# Altium schematic sheet Power.SchDoc
size A4; SheetNumber: 1; SheetTotal: 4
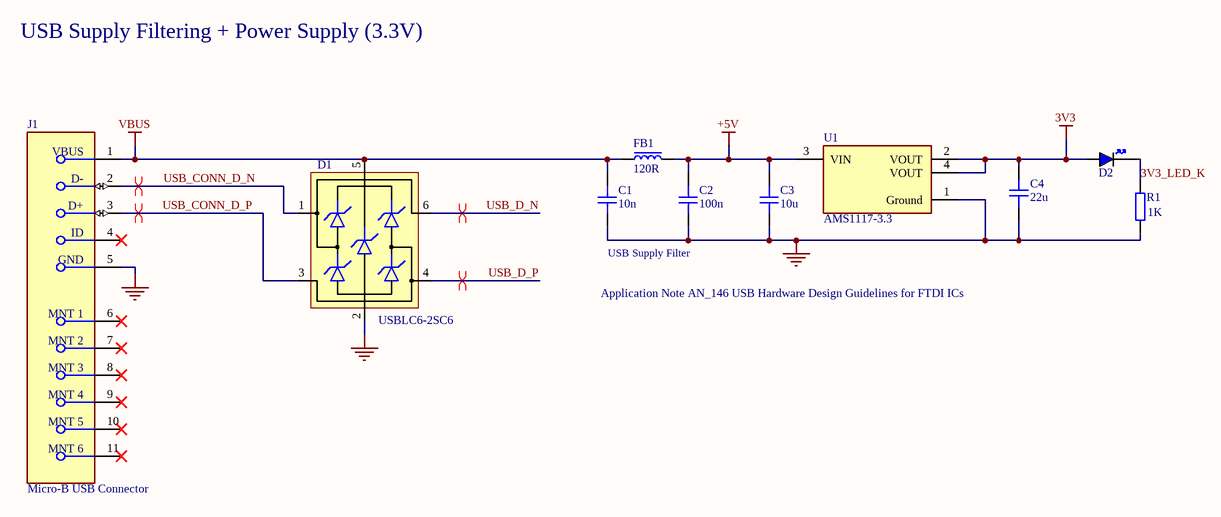
[diagram p0: Power.SchDoc]

## Parts
C1  10n  [CAP_0603]
C2  100n  [CAP_0603]
C3  10u  [CAP_0603]
C4  22u  [CAP_0603]
D1  USBLC6-2SC6  [SOT-23-6]
D2  BLUE  [LED_0402_BLUE]  (value not drawn)
FB1  120R  [FB_0603]
J1  Micro-B USB Connector  [FP-473460001-MFG]
R1  1K  [RES_0402]
U1  AMS1117-3.3  [FP-AMS1117-IPC_C]

## Nets
3V3: C4.2 D2.A U1.2(VOUT) U1.4(VOUT)
+5V: C2.2 C3.2 FB1.2 U1.3(VIN)
GND: C1.1 C2.1 C3.1 C4.1 D1.2(GND) J1.5(GND) R1.2 U1.1(Ground)
VBUS: C1.2 D1.5(VBUS) FB1.1 J1.1(VBUS)
3V3_LED_K: D2.K R1.1
USB_CONN_D_N: D1.1(IO1) J1.2(D-)
USB_CONN_D_P: D1.3(IO2) J1.3(D+)
USB_D_N: D1.6(IO1)
USB_D_P: D1.4(IO2)

Not connected (* = marked no-connect by the designer): J1 4(ID)* 6(MNT_1)* 7(MNT_2)* 8(MNT_3)* 9(MNT_4)* 10(MNT_5)* 11(MNT_6)*

## Layout directives
differential pair: USB_CONN_D_N, USB_CONN_D_P, USB_D_N, USB_D_P

## Notes on the sheet
- USB Supply Filtering + Power Supply (3.3V)
- Application Note AN_146 USB Hardware Design Guidelines for FTDI ICs
- USB Supply Filter

## Library data of the parts
C1-C4 = CAP_0603: Capacitor SMD 0603; Manufacturer: *; Manufacturer Part Number: *; Distributor Link: *; LCSC: *; Rating: *; Dielectric: *
D1 = USBLC6-2SC6: Low-Capacitance ESD Protection USB; Manufacturer: STMicroelectronics; Manufacturer Part Number: USBLC6-2SC6; Distributor Link: https://www.mouser.de/ProductDetail/STMicroelectronics/USBLC6-2SC6?qs=po45yt2pPpu%2FhNIlwQdTlg%3D%3D
D2 = LED_0402_BLUE: LED 0402 BLUE SMD
FB1 = FB_0603: Ferrite Bead SMD 0603; Manufacturer: *; Manufacturer Part Number: *; Distributor Link: *; LCSC: *
J1 = CMP-2000-05246-2: CONN RCPT USB2.0 MICRO B SMD R/A; Manufacturer: Molex; Manufacturer Part Number: 473460001; Conn Orientation: Right Angle; Is Female: yes; Shielding: true; Pitch: 0.65mm; Number Of Contacts: 5; Voltage Rating: 30V; Current Rating: 1.8A; Device Class L2: USB Connectors; Digikey Description: CONN RCPT USB2.0 MICRO B SMD R/A; Height: 2.945mm; RoHS: TRUE; ComponentLink2Description: Datasheet; Octopart: https://octopart.com/47346-0001-molex-7164928; Automotive: No; Package: 0; Category: Conn; Device Class L1: Connectors; Usb Standard: USB 2.0; Temperature: -30°C to +85°C; Temperature Range Low: -30°C; Footprint Url: https://www.molex.com/pdm_docs/sd/473460001_sd.pdf; ComponentLink2URL: https://www.molex.com/webdocs/datasheets/pdf/en-us/0473460001_IO_CONNECTORS.pdf; Lead Free: Yes; Contact Material: Gold,Nickel; Temperature Range High: +85°C; Device Class L3: unset
R1 = RES_0402: Resistor SMD 0402; Manufacturer: *; Manufacturer Part Number: *; Distributor Link: *; LCSC: *
U1 = CMP-209535-000001-1: LDO Voltage Regulators 1A, 3.3V; Manufacturer: Advanced Monolithic Systems; Dropout Voltage: 1.1V; Output Type: Fixed; Nominal Supply Current: 5mA; Max Power Dissipation: 1.2W; Max Supply Voltage: 15V; Number Of Outputs: 1; Standoff Height: 0.64mm; Max Junction Temp: +125°C; Height: 1.8mm; Package: AMS1117; Device Class L2: Power Management ICs; ComponentLink2Description: Datasheet; ComponentLink2URL: http://www.advanced-monolithic.com/pdf/ds1117.pdf; Category: IC; RoHS: TRUE; Automotive: No; Device Class L1: Integrated Circuits (ICs); Output Current: 1A; Device Class L3: Voltage Regulators - Linear; Temperature: -40°C to +125°C; Output Voltage: 3.3V; Manufacturer Part Number: AMS1117-3.3; Temperature Range Low: -40°C; Octopart: https://octopart.com/ams1117-3.3-advanced+monolithic+systems-25899300; Lead Free: Yes; Ipc Land Pattern Name: SOT229P700X180-4; Temperature Range High: +125°C